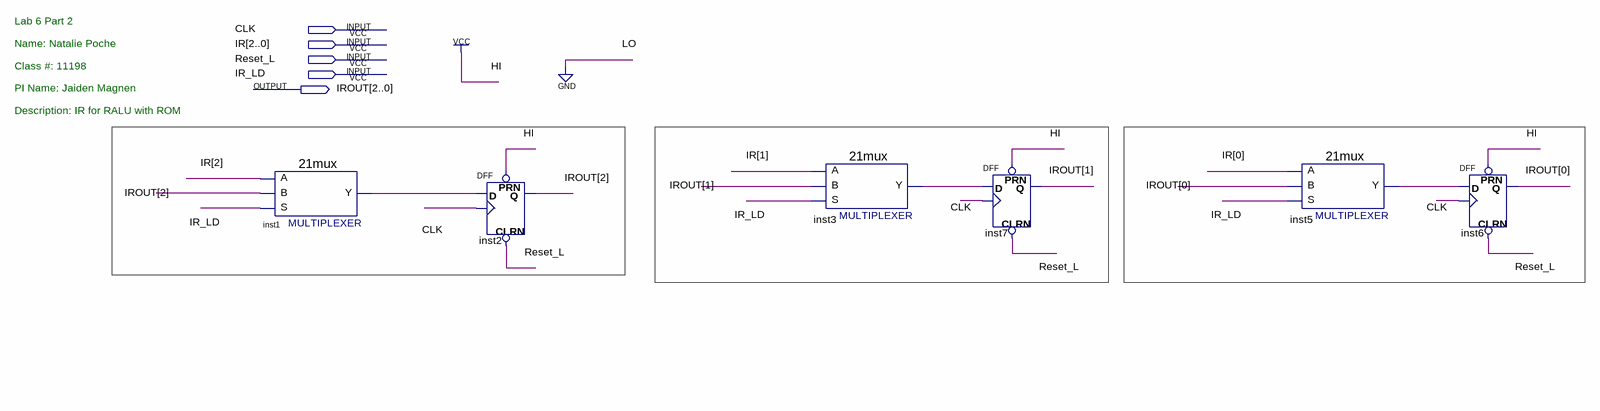
[diagram p0: schematic sheet]
// Quartus schematic IR.bdf as structural Verilog: 6 symbols, 5 pins
module IR (
  input  CLK,
  input  [2:0] IR,
  input  Reset_L,
  input  IR_LD,
  output [2:0] IROUT
);

  wire inst1_y, inst3_y, inst5_y;

  \21mux  inst1 (.S(IR_LD), .B(IROUT[2]), .A(IR[2]), .Y(inst1_y));
  DFF inst2 (.CLRN(Reset_L), .CLK(CLK), .D(inst1_y), .PRN(1'b1), .Q(IROUT[2]));
  \21mux  inst3 (.S(IR_LD), .B(IROUT[1]), .A(IR[1]), .Y(inst3_y));
  DFF inst7 (.CLRN(Reset_L), .CLK(CLK), .D(inst3_y), .PRN(1'b1), .Q(IROUT[1]));
  \21mux  inst5 (.S(IR_LD), .B(IROUT[0]), .A(IR[0]), .Y(inst5_y));
  DFF inst6 (.CLRN(Reset_L), .CLK(CLK), .D(inst5_y), .PRN(1'b1), .Q(IROUT[0]));

  // Notes on the sheet:
  //   Lab 6 Part 2
  //   Name: Natalie Poche
  //   Class #: 11198
  //   PI Name: Jaiden Magnen
  //   Description: IR for RALU with ROM
endmodule
